# Altium schematic sheet mem.SchDoc
size A4
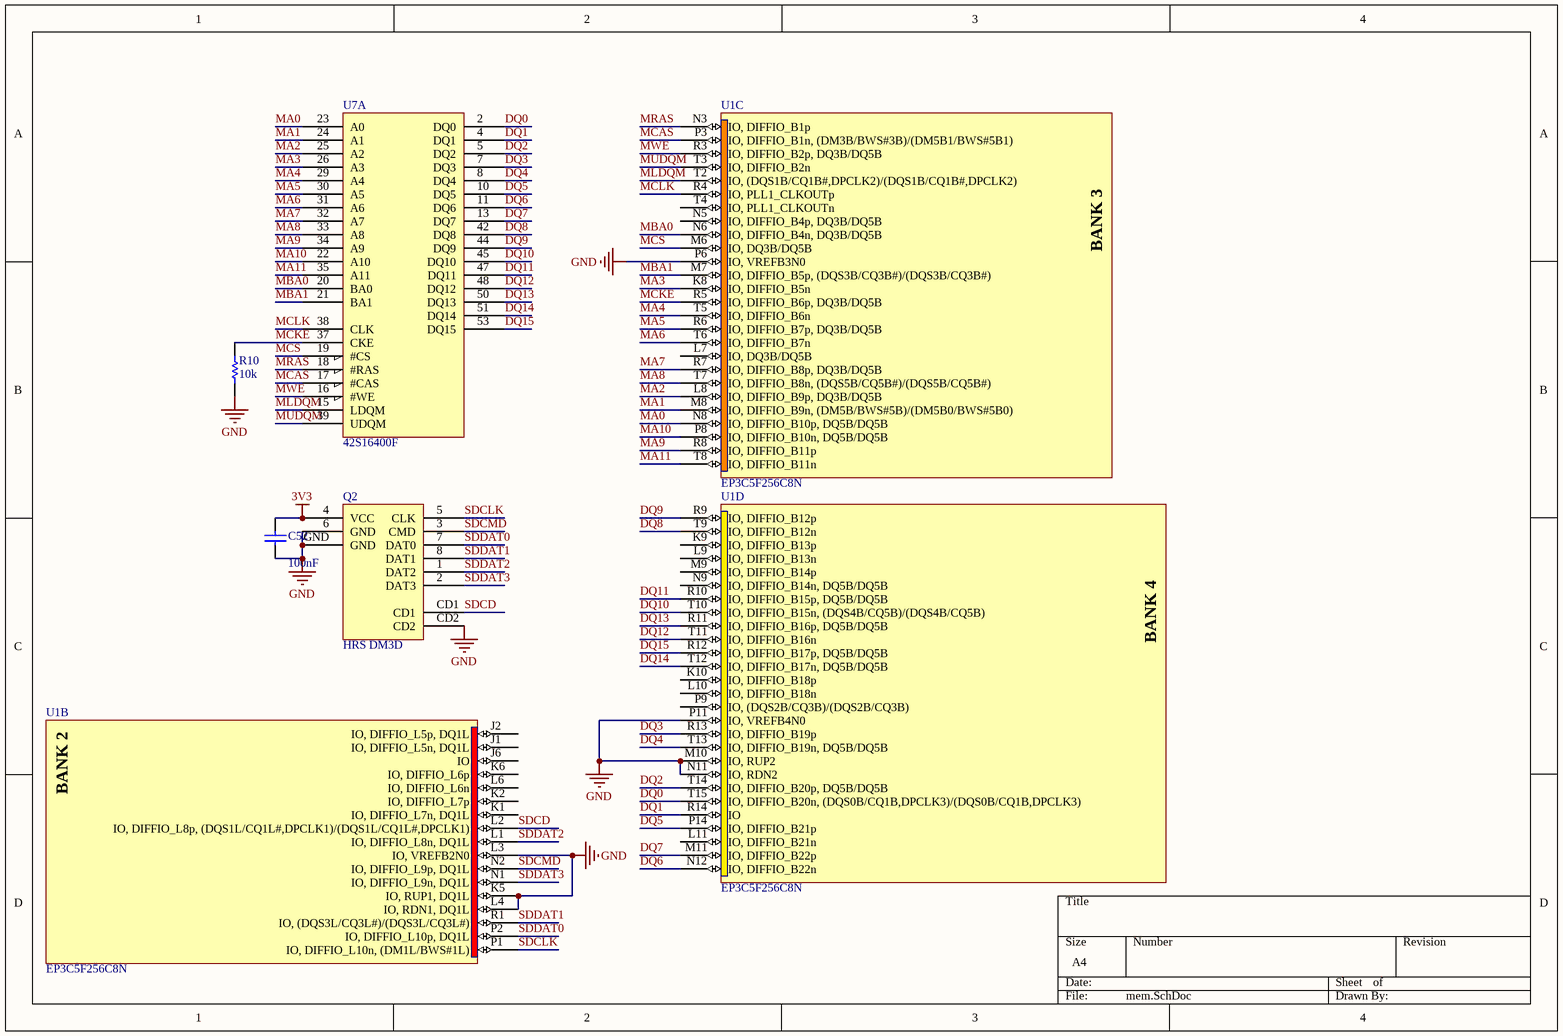
[diagram p0: mem.SchDoc]

## Parts
C52  value 100nF  [CAPC1005X06L]
Q2  HRS DM3D  [HRS DM3D]
R10  value 10k  [CAPC2012X135N]  (hidden comment: Res1)
U1  EP3C5F256C8N  [FBGA256-2]  (parts B,C,D of 13)
U7  42S16400F  [54_TSOP2_400AF_N]  (part A of 2)

## Nets
3V3: C52.2 Q2.4(VCC)
GND: C52.1 Q2.6(GND) Q2.CD2 Q2.GND R10.1 U1.K5(IO,_RUP1,_DQ1L) U1.L3(IO,_VREFB2N0) U1.L4(IO,_RDN1,_DQ1L) U1.M10(IO,_RUP2) U1.N11(IO,_RDN2) U1.P6(IO,_VREFB3N0) U1.P11(IO,_VREFB4N0)
DQ0: U1.T15(IO,_DIFFIO_B20n,_(DQS0B/CQ1B,DPCLK3)/(DQS0B/CQ1B,DPCLK3)) U7.2(DQ0)
DQ1: U1.R14(IO) U7.4(DQ1)
DQ2: U1.T14(IO,_DIFFIO_B20p,_DQ5B/DQ5B) U7.5(DQ2)
DQ3: U1.R13(IO,_DIFFIO_B19p) U7.7(DQ3)
DQ4: U1.T13(IO,_DIFFIO_B19n,_DQ5B/DQ5B) U7.8(DQ4)
DQ5: U1.P14(IO,_DIFFIO_B21p) U7.10(DQ5)
DQ6: U1.N12(IO,_DIFFIO_B22n) U7.11(DQ6)
DQ7: U1.M11(IO,_DIFFIO_B22p) U7.13(DQ7)
DQ8: U1.T9(IO,_DIFFIO_B12n) U7.42(DQ8)
DQ9: U1.R9(IO,_DIFFIO_B12p) U7.44(DQ9)
DQ10: U1.T10(IO,_DIFFIO_B15n,_(DQS4B/CQ5B)/(DQS4B/CQ5B)) U7.45(DQ10)
DQ11: U1.R10(IO,_DIFFIO_B15p,_DQ5B/DQ5B) U7.47(DQ11)
DQ12: U1.T11(IO,_DIFFIO_B16n) U7.48(DQ12)
DQ13: U1.R11(IO,_DIFFIO_B16p,_DQ5B/DQ5B) U7.50(DQ13)
DQ14: U1.T12(IO,_DIFFIO_B17n,_DQ5B/DQ5B) U7.51(DQ14)
DQ15: U1.R12(IO,_DIFFIO_B17p,_DQ5B/DQ5B) U7.53(DQ15)
MA0: U1.N8(IO,_DIFFIO_B10p,_DQ5B/DQ5B) U7.23(A0)
MA1: U1.M8(IO,_DIFFIO_B9n,_(DM5B/BWS#5B)/(DM5B0/BWS#5B0)) U7.24(A1)
MA2: U1.L8(IO,_DIFFIO_B9p,_DQ3B/DQ5B) U7.25(A2)
MA3: U1.K8(IO,_DIFFIO_B5n) U7.26(A3)
MA4: U1.T5(IO,_DIFFIO_B6n) U7.29(A4)
MA5: U1.R6(IO,_DIFFIO_B7p,_DQ3B/DQ5B) U7.30(A5)
MA6: U1.T6(IO,_DIFFIO_B7n) U7.31(A6)
MA7: U1.R7(IO,_DIFFIO_B8p,_DQ3B/DQ5B) U7.32(A7)
MA8: U1.T7(IO,_DIFFIO_B8n,_(DQS5B/CQ5B#)/(DQS5B/CQ5B#)) U7.33(A8)
MA9: U1.R8(IO,_DIFFIO_B11p) U7.34(A9)
MA10: U1.P8(IO,_DIFFIO_B10n,_DQ5B/DQ5B) U7.22(A10)
MA11: U1.T8(IO,_DIFFIO_B11n) U7.35(A11)
MBA0: U1.N6(IO,_DIFFIO_B4n,_DQ3B/DQ5B) U7.20(BA0)
MBA1: U1.M7(IO,_DIFFIO_B5p,_(DQS3B/CQ3B#)/(DQS3B/CQ3B#)) U7.21(BA1)
MCAS: U1.P3(IO,_DIFFIO_B1n,_(DM3B/BWS#3B)/(DM5B1/BWS#5B1)) U7.17(#CAS)
MCKE: R10.2 U1.R5(IO,_DIFFIO_B6p,_DQ3B/DQ5B) U7.37(CKE)
MCLK: U1.R4(IO,_PLL1_CLKOUTp) U7.38(CLK)
MCS: U1.M6(IO,_DQ3B/DQ5B) U7.19(#CS)
MLDQM: U1.T2(IO,_(DQS1B/CQ1B#,DPCLK2)/(DQS1B/CQ1B#,DPCLK2)) U7.15(LDQM)
MRAS: U1.N3(IO,_DIFFIO_B1p) U7.18(#RAS)
MUDQM: U1.T3(IO,_DIFFIO_B2n) U7.39(UDQM)
MWE: U1.R3(IO,_DIFFIO_B2p,_DQ3B/DQ5B) U7.16(#WE)
SDCD: Q2.CD1 U1.L2(IO,_DIFFIO_L8p,_(DQS1L/CQ1L#,DPCLK1)/(DQS1L/CQ1L#,DPCLK1))
SDCLK: Q2.5(CLK) U1.P1(IO,_DIFFIO_L10n,_(DM1L/BWS#1L))
SDCMD: Q2.3(CMD) U1.N2(IO,_DIFFIO_L9p,_DQ1L)
SDDAT0: Q2.7(DAT0) U1.P2(IO,_DIFFIO_L10p,_DQ1L)
SDDAT1: Q2.8(DAT1) U1.R1(IO,_(DQS3L/CQ3L#)/(DQS3L/CQ3L#))
SDDAT2: Q2.1(DAT2) U1.L1(IO,_DIFFIO_L8n,_DQ1L)
SDDAT3: Q2.2(DAT3) U1.N1(IO,_DIFFIO_L9n,_DQ1L)

Not connected (* = marked no-connect by the designer): U1 J1(IO,_DIFFIO_L5n,_DQ1L) J2(IO,_DIFFIO_L5p,_DQ1L) J6(IO) K1(IO,_DIFFIO_L7n,_DQ1L) K2(IO,_DIFFIO_L7p) K6(IO,_DIFFIO_L6p) K9(IO,_DIFFIO_B13p) K10(IO,_DIFFIO_B18p) L6(IO,_DIFFIO_L6n) L7(IO,_DQ3B/DQ5B) L9(IO,_DIFFIO_B13n) L10(IO,_DIFFIO_B18n) L11(IO,_DIFFIO_B21n) M9(IO,_DIFFIO_B14p) N5(IO,_DIFFIO_B4p,_DQ3B/DQ5B) N9(IO,_DIFFIO_B14n,_DQ5B/DQ5B) P9(IO,_(DQS2B/CQ3B)/(DQS2B/CQ3B)) T4(IO,_PLL1_CLKOUTn)

## Notes on the sheet
- (in symbol EP3C5F256C8N, part B) BANK 2
- (in symbol EP3C5F256C8N, part C) BANK 3
- (in symbol EP3C5F256C8N, part D) BANK 4

## Library data of the parts
C52 = Cap: Capacitor; Published: 8-Jun-2000; LatestRevisionDate: 17-Jul-2002; LatestRevisionNote: Re-released for DXP Platform.; PackageReference: RAD-0.3; Publisher: Altium Limited; PackageDescription: Radial Cap, Thru-Hole; 2 Leads; 0.3 in Pin Spacing
R10 = Res1: Resistor; Published: 8-Jun-2000; LatestRevisionDate: 17-Jul-2002; LatestRevisionNote: Re-released for DXP Platform.; PackageReference: AXIAL-0.3; Publisher: Altium Limited; PackageDescription: Axial Device, Thru-Hole; 2 Leads; 0.3 in Pin Spacing
U1 = EP3C5F256C8N: Cyclone III Family FPGA, 182 I/O Pins, 4 PLLs, 256-Pin FBGA, Speed Grade 8, Commercial Grade, Pb-Free; Published: 14-Mar-2008; DatasheetVersion: ver2.0, May-2008; PackageVersion: ver16.0, Dec-2009; PackageReference: FBGA256-2; Publisher: Altium Limited; PackageDescription: 256-Ball FineLine Ball Grid Array (FBGA256) - Option 2 - Wire Bond; Supplier 1: Digi-Key; Supplier Part Number 1: 544-2423-ND; Supplier 2: Farnell; Supplier Part Number 2: 1549367; Supplier 3: Farnell; Supplier Part Number 3: 1662274; Code_JEDEC: MO-192-DAF-1; ComponentLink1Description: Manufacturer Link; ComponentLink1URL: http://www.altera.com/; ComponentLink2Description: Handbook (7.86MB); ComponentLink2URL: http://www.altera.com/literature/hb/cyc3/cyclone3_handbook.pdf; ComponentLink3Description: Packaging Specification; ComponentLink3URL: http://www.altera.com/literature/ds/dspkg.pdf
U7 = 45S16400F